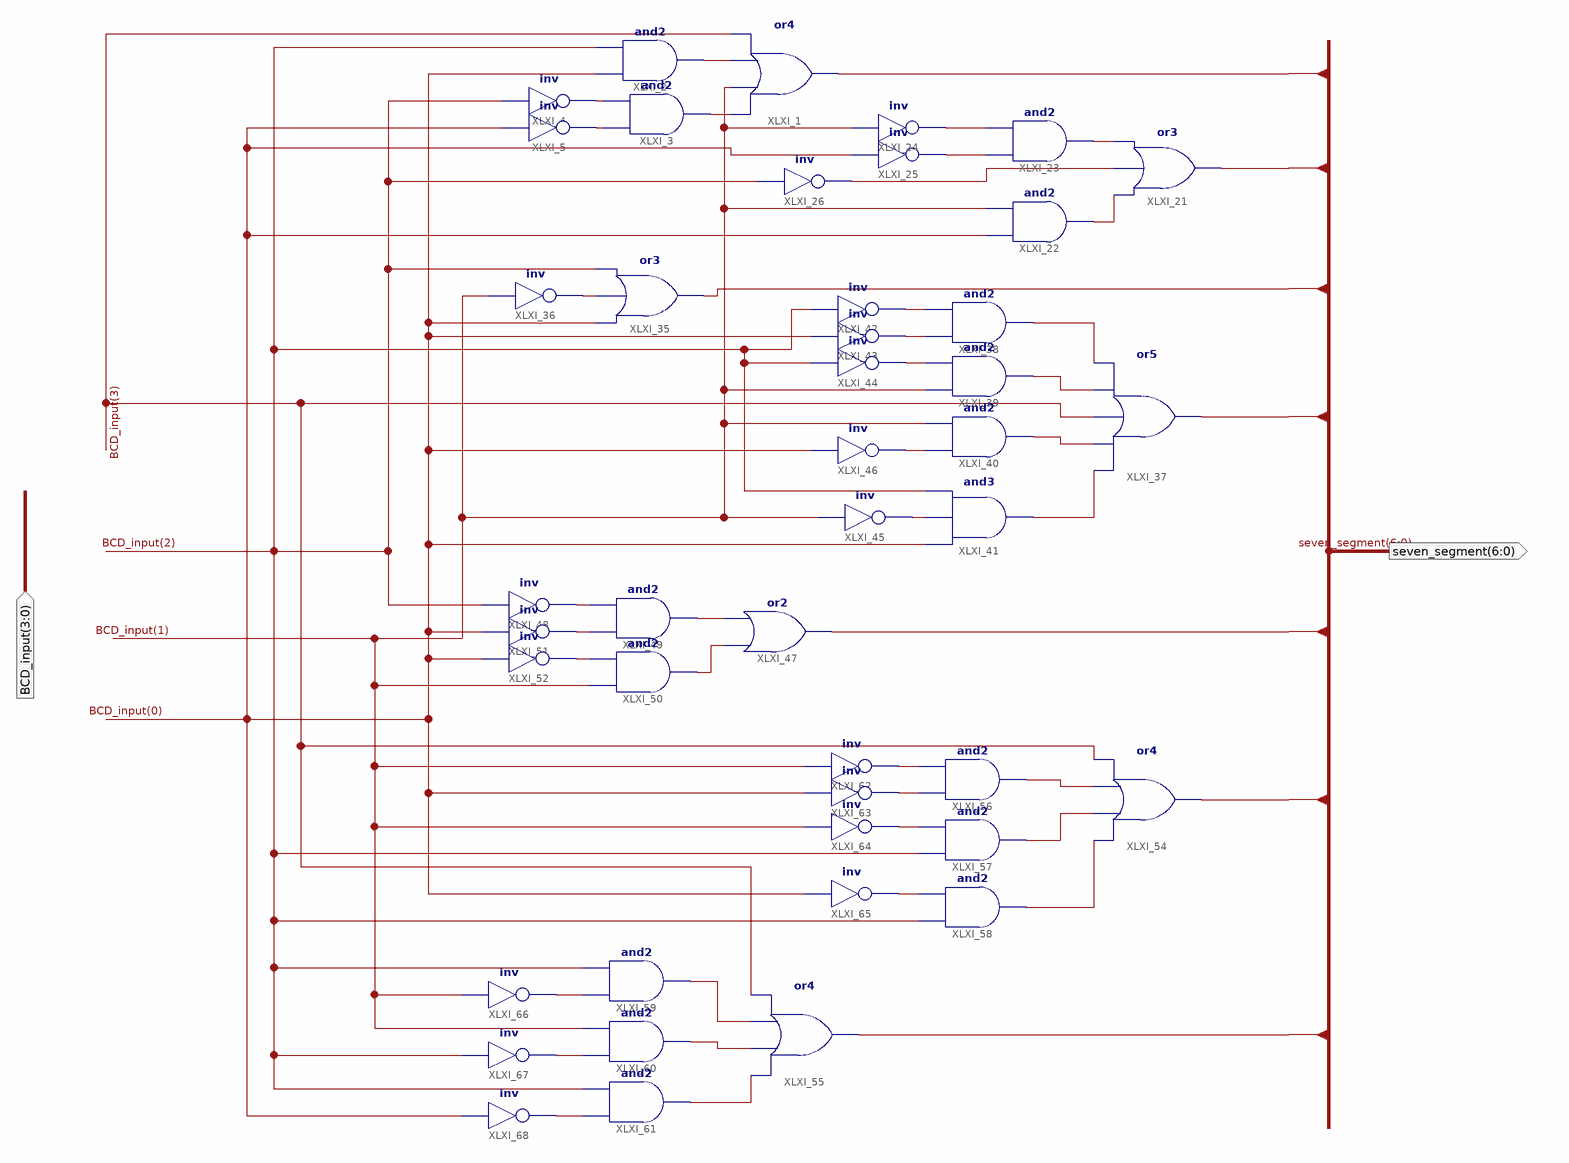
[diagram p0: schematic sheet 1]
// Xilinx ISE schematic BCD_seven_segment_decoder.sch (artix7) as structural Verilog: 44 symbols, 2 ports
module BCD_seven_segment_decoder (
  input  [3:0] BCD_input,
  output [6:0] seven_segment
);

  wire XLXN_10, XLXN_11, XLXN_12, XLXN_13, XLXN_36, XLXN_37, XLXN_38, XLXN_39, XLXN_40, XLXN_56, XLXN_60,
       XLXN_61, XLXN_62, XLXN_63, XLXN_64, XLXN_65, XLXN_66, XLXN_67, XLXN_68, XLXN_76, XLXN_77, XLXN_78,
       XLXN_79, XLXN_80, XLXN_85, XLXN_86, XLXN_87, XLXN_88, XLXN_89, XLXN_90, XLXN_93, XLXN_94, XLXN_95,
       XLXN_96, XLXN_97, XLXN_98, XLXN_99;

  or XLXI_1 (seven_segment[6], XLXN_13, BCD_input[1], XLXN_10, BCD_input[3]);
  and XLXI_2 (XLXN_10, BCD_input[0], BCD_input[2]);
  and XLXI_3 (XLXN_13, XLXN_12, XLXN_11);
  not XLXI_4 (XLXN_11, BCD_input[2]);
  not XLXI_5 (XLXN_12, BCD_input[0]);
  not XLXI_26 (XLXN_36, BCD_input[2]);
  not XLXI_25 (XLXN_40, BCD_input[0]);
  not XLXI_24 (XLXN_37, BCD_input[1]);
  and XLXI_23 (XLXN_38, XLXN_40, XLXN_37);
  and XLXI_22 (XLXN_39, BCD_input[0], BCD_input[1]);
  or XLXI_21 (seven_segment[5], XLXN_39, XLXN_36, XLXN_38);
  or XLXI_35 (seven_segment[4], BCD_input[0], XLXN_56, BCD_input[2]);
  not XLXI_36 (XLXN_56, BCD_input[1]);
  or XLXI_37 (seven_segment[3], XLXN_68, XLXN_67, BCD_input[3], XLXN_66, XLXN_65);
  and XLXI_38 (XLXN_65, XLXN_61, XLXN_60);
  and XLXI_39 (XLXN_66, BCD_input[1], XLXN_62);
  and XLXI_40 (XLXN_67, XLXN_63, BCD_input[1]);
  and XLXI_41 (XLXN_68, BCD_input[0], XLXN_64, BCD_input[2]);
  not XLXI_42 (XLXN_60, BCD_input[2]);
  not XLXI_43 (XLXN_61, BCD_input[0]);
  not XLXI_44 (XLXN_62, BCD_input[2]);
  not XLXI_45 (XLXN_64, BCD_input[1]);
  not XLXI_46 (XLXN_63, BCD_input[0]);
  or XLXI_47 (seven_segment[2], XLXN_77, XLXN_76);
  not XLXI_48 (XLXN_78, BCD_input[2]);
  and XLXI_49 (XLXN_76, XLXN_79, XLXN_78);
  and XLXI_50 (XLXN_77, BCD_input[1], XLXN_80);
  not XLXI_51 (XLXN_79, BCD_input[0]);
  not XLXI_52 (XLXN_80, BCD_input[0]);
  or XLXI_54 (seven_segment[1], XLXN_87, XLXN_86, XLXN_85, BCD_input[3]);
  and XLXI_56 (XLXN_85, XLXN_94, XLXN_93);
  and XLXI_57 (XLXN_86, BCD_input[2], XLXN_95);
  and XLXI_58 (XLXN_87, BCD_input[2], XLXN_96);
  not XLXI_62 (XLXN_93, BCD_input[1]);
  not XLXI_63 (XLXN_94, BCD_input[0]);
  not XLXI_64 (XLXN_95, BCD_input[1]);
  not XLXI_65 (XLXN_96, BCD_input[0]);
  or XLXI_55 (seven_segment[0], XLXN_90, XLXN_89, XLXN_88, BCD_input[3]);
  and XLXI_59 (XLXN_88, XLXN_97, BCD_input[2]);
  and XLXI_60 (XLXN_89, XLXN_98, BCD_input[1]);
  and XLXI_61 (XLXN_90, XLXN_99, BCD_input[2]);
  not XLXI_66 (XLXN_97, BCD_input[1]);
  not XLXI_67 (XLXN_98, BCD_input[2]);
  not XLXI_68 (XLXN_99, BCD_input[0]);
endmodule
